# EAGLE schematic bottom-breakout (EAGLE 9.4.2)
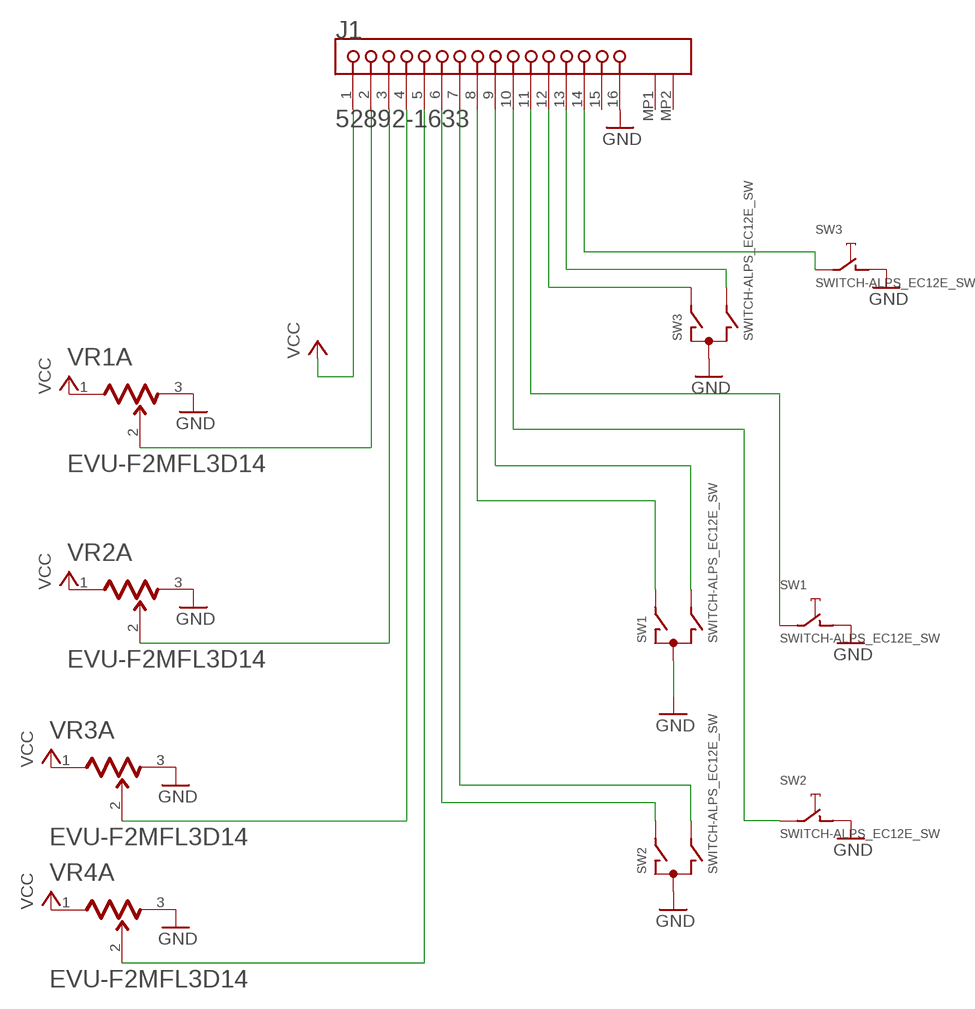
[diagram p0: schematic, sheet 1]

## Parts
J1  MOLEX_52892-1633MOLEX_52892-1633_0_0  [MOLEX_52892-1633_0]
SW1  SWITCH-ALPS_EC12E_SW  [SWITCH-ALPS_ALPS_EC12E_SW]
SW2  SWITCH-ALPS_EC12E_SW  [SWITCH-ALPS_ALPS_EC12E_SW]
SW3  SWITCH-ALPS_EC12E_SW  [SWITCH-ALPS_ALPS_EC12E_SW]
VR1  PANASONIC_EVU-F2MFL3D14PANASONIC_EVU-F2MFL3D14_0_0  [PANASONIC_EVU-F2MFL3D14_0]
VR2  PANASONIC_EVU-F2MFL3D14PANASONIC_EVU-F2MFL3D14_0_0  [PANASONIC_EVU-F2MFL3D14_0]
VR3  PANASONIC_EVU-F2MFL3D14PANASONIC_EVU-F2MFL3D14_0_0  [PANASONIC_EVU-F2MFL3D14_0]
VR4  PANASONIC_EVU-F2MFL3D14PANASONIC_EVU-F2MFL3D14_0_0  [PANASONIC_EVU-F2MFL3D14_0]

## Nets
GND: J1.16 SW1.C SW1.D SW2.C SW2.D SW3.C SW3.D VR1.3 VR2.3 VR3.3 VR4.3
N$1: J1.2 VR1.2
N$2: J1.3 VR2.2
N$3: J1.4 VR3.2
N$4: J1.6 SW2.A
N$5: J1.7 SW2.B
N$6: J1.8 SW1.A
N$7: J1.9 SW1.B
N$8: J1.10 SW2.E
N$9: J1.11 SW1.E
N$10: J1.5 VR4.2
N$11: J1.12 SW3.A
N$12: J1.13 SW3.B
N$13: J1.14 SW3.E
VCC: J1.1 VR1.1 VR2.1 VR3.1 VR4.1
Unconnected: J1.15 J1.MP1 J1.MP2 SW1.GND1(G) SW1.GND2(G) SW2.GND1(G) SW2.GND2(G) SW3.GND1(G) SW3.GND2(G) VR1.4(B:MNT_1) VR1.5(B:MNT_2) VR2.4(B:MNT_1) VR2.5(B:MNT_2) VR3.4(B:MNT_1) VR3.5(B:MNT_2) VR4.4(B:MNT_1) VR4.5(B:MNT_2)

## Library data of the parts
J1 = Molex - 52892-1633:MOLEX_52892-1633: MOLX-52892-1633; CIIVA_IDS: 12958044; CIRCUITS_LOADED: 16; COMPONENT_LINK_1_DESCRIPTION: Manufacturer URL; COMPONENT_LINK_1_URL: http://www.molex.com/molex/index.jsp; COMPONENT_LINK_3_DESCRIPTION: Package Specification; COMPONENT_LINK_3_URL: http://www.molex.com/pdm_docs/sd/528921633_sd.pdf; CONTACT_POSITION: Bottom; CURRENT_MAX_PER_CONTACT: 0.5A; DATASHEET: http://www.molex.com/webdocs/datasheets/pdf/en-us/0528921633_FFC_FPC_CONNECTORS.pdf; DURABILITY_MATING_CYCLES_MAX: 20; ENTRY_ANGLE: 90degrees Angle; FOOTPRINT_VARIANT_NAME_0: Manufacturer Recommended; IMPORTED: yes; IMPORTED_FROM: vault; IMPORT_TS: 1521865775; MATED_HEIGHT: 2.00mm; MATERIAL___METAL: Phosphor Bronze; MATERIAL___PLATING_MATING: Silver, Tin-Bismuth; MATERIAL___PLATING_TERMINATION: Silver, Tin-Bismuth; MF: Molex; MOUNTING_TECHNOLOGY: Surface Mount; MPN: 52892-1633; NUMBER_OF_ROWS: 1; ORIENTATION: Right Angle; PACKAGE: 52892-1633; PACKAGE_DESCRIPTION: 16-Lead FPC Connector, Pitch 0.5 mm; PACKAGE_VERSION: Rev. A, 05/2013; PACKING: Tape and Reel; PCB_LOCATOR: No; PCB_RETENTION: Yes; PITCH___MATING_INTERFACE: 0.50mm; PITCH___TERMINATION_INTERFACE: 0.50mm; POLARIZED_TO_PCB: No; PREFIX: J; RELEASE_DATE: 1411372667; ROHS: Yes; STACKABLE: No; VAULT_GUID: C24F345D-8B09-4EB3-B126-737F836EC0CC; VAULT_REVISION: B04BDDE3-DCC0-4E22-88B5-2BA07A3C3672; VOLTAGE_MAX: 50V
SW1-SW3 = interface:SWITCH-ALPS_EC12E_SW: ALPS rotary Encoder EC12E series with switch; MPN: EC12E2424407; OC_FARNELL: 1520813; OC_NEWARK: 74M1068
VR1-VR4 = Panasonic - EVU-F2MFL3D14:PANASONIC_EVU-F2MFL3D14: Square Rotary Potentiometers with Insulated Shaft; CENTROID_NOT_SPECIFIED: Yes; DATASHEET: https://upverter.com/datasheet/0e6f35378f82932eabea89c93832ce37004881c1.pdf; DIGIKEY_DESCRIPTION: RES POT 10K OHM 1/20W LOGARITHMIC; DIGIKEY_PART_NUMBER: P3H8103-ND; LEAD_FREE: yes; MF: Panasonic; MOUSER_PART_NUMBER: 667-EVU-F2MFL3D14; MPN: EVU-F2MFL3D14; PACKAGE: PTH_POT_12MM5_9MM7; POWER: 50mW; PREFIX: VR; RESISTANCE: 10kΩ; ROHS: yes